# Altium project PCB_wksp.PrjPcb
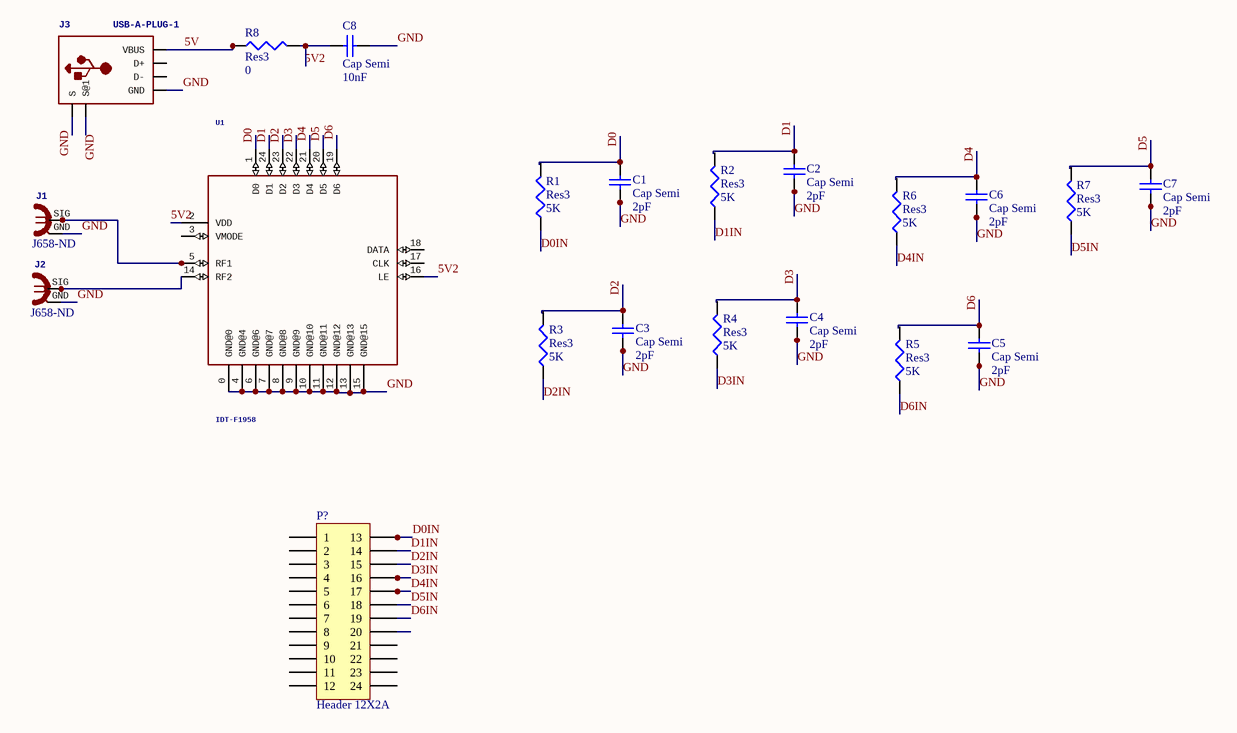
[diagram p0: Sheet1.SchDoc]
1 sheet, 21 parts. Net scope: global (net labels, ports and power ports of the same name join across sheets).
Board file: PCB1.PcbDoc

## Sheet Sheet1.SchDoc
size A4

### Parts
C1  Cap Semi  value 2pF  [1608[0603]]
C2  Cap Semi  value 2pF  [1608[0603]]
C3  Cap Semi  value 2pF  [1608[0603]]
C4  Cap Semi  value 2pF  [1608[0603]]
C5  Cap Semi  value 2pF  [1608[0603]]
C6  Cap Semi  value 2pF  [1608[0603]]
C7  Cap Semi  value 2pF  [1608[0603]]
C8  Cap Semi  value 10nF  [1608[0603]]
J1  Supplier Part Number 1: J658-ND  [SMA-OSHPARK-4L-1.6MM- ALT3]  (hidden comment: SMA 50 Ohm edge)
J2  Supplier Part Number 1: J658-ND  [SMA-OSHPARK-4L-1.6MM- ALT3]  (hidden comment: SMA 50 Ohm edge)
J3  USB-A-PLUG-1  [USB-A-PLUG-1]
P?  Header 12X2A  [HDR2X12_CEN]
R1  Res3  value 5K  [J1-0603]
R2  Res3  value 5K  [J1-0603]
R3  Res3  value 5K  [J1-0603]
R4  Res3  value 5K  [J1-0603]
R5  Res3  value 5K  [J1-0603]
R6  Res3  value 5K  [J1-0603]
R7  Res3  value 5K  [J1-0603]
R8  Res3  value 0  [J1-0603]
U1  IDT-F1958  [VFQFPN-24]

### Nets
5V: J3.1(VBUS) R8.1
5V2: U1.2(VDD) U1.16(LE)
D0: C1.2 U1.1(D0)
D0IN: P?.13 R1.1
D1: C2.2 U1.24(D1)
D1IN: P?.14 R2.1
D2: C3.2 U1.23(D2)
D2IN: P?.15 R3.1
D3: C4.2 U1.22(D3)
D3IN: P?.16 R4.1
D4: C6.2 U1.21(D4)
D4IN: P?.17 R6.1
D5: C7.2 U1.20(D5)
D5IN: P?.18 R7.1
D6: C5.2 U1.19(D6)
D6IN: P?.19 R5.1
GND: C1.1 C2.1 C3.1 C4.1 C5.1 C6.1 C7.1 C8.2 J1.GND J2.GND J3.4(GND) U1.0(GND@0) U1.4(GND@4) U1.6(GND@6) U1.7(GND@7) U1.8(GND@8) U1.9(GND@9) U1.10(GND@10) U1.11(GND@11) U1.12(GND@12) U1.13(GND@13) U1.15(GND@15)
NetC8_1: C8.1 R8.2
NetJ1_SIG: J1.SIG U1.5(RF1)
NetJ2_SIG: J2.SIG U1.14(RF2)

Not connected (* = marked no-connect by the designer): J3 2(D-) 3(D+) M1(S) M2(S@1); P? 1 2 3 4 5 6 7 8 9 10 11 12 20 21 22 23 24; R1 2; R2 2; R3 2; R4 2; R5 2; R6 2; R7 2; U1 3(VMODE) 17(CLK) 18(DATA)

### Notes on the sheet
- Labels drawn without touching a wire or pin: 5V2, GND

### Library data of the parts
C1-C8 = Cap Semi: Capacitor (Semiconductor SIM Model); Published: 8-Jun-2000; LatestRevisionDate: 29-May-2009; LatestRevisionNote: IPC-7351 Footprint Added.; PackageReference: C1206; Publisher: Altium Limited; PackageDescription: Chip Capacitor
J1 J2 = SMA-OSHPARK-4L-1.6MM-ALT3: GateName_1: G1; SymbolName_1: COAX; DeviceName: -OSHPARK-4L-1.6MM; LibraryName: dword1511-connectors; DeviceSetName: SMA; Package: SMA-OSHPARK-4L-1.6MM; Supplier 1: Digi-Key
J3 = USB-A-PLUG-1: GateName_1: G$1; SymbolName_1: USB-A-2S; DeviceName: 1; LibraryName: dword1511-connectors; DeviceSetName: USB-A-PLUG-; Package: USB-A-PLUG-1
P? = Header 12X2A: Header, 12-Pin, Dual row; LatestRevisionDate: 17-Jul-2002; LatestRevisionNote: Re-released for DXP Platform.; Publisher: Altium Limited
R1-R8 = Res3: Resistor; Published: 8-Jun-2000; LatestRevisionDate: 29-May-2009; LatestRevisionNote: IPC-7351 Footprint Added.; PackageReference: J1-0603; Publisher: Altium Limited; PackageDescription: Chip Resistor
U1 = IDT-F1958: GateName_1: G$1; SymbolName_1: F1958; LibraryName: wcsn_parts; DeviceSetName: IDT-F1958; Package: VFQFPN-24